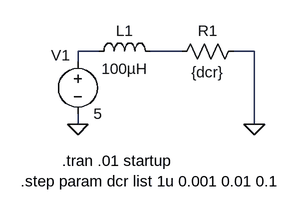
[diagram p0: schematic runaway_inductor.asc]
runaway_inductor.asc, the LTspice schematic file:
Version 4
SHEET 1 880 680
WIRE 128 160 96 160
WIRE 256 160 208 160
WIRE 368 160 336 160
WIRE 96 176 96 160
WIRE 96 272 96 256
WIRE 368 272 368 160
FLAG 96 272 0
FLAG 368 272 0
SYMBOL ind 112 176 R270
WINDOW 0 32 56 VTop 2
WINDOW 3 5 56 VBottom 2
SYMATTR InstName L1
SYMATTR Value 100µH
SYMBOL voltage 96 160 R0
WINDOW 0 -41 6 Left 2
WINDOW 123 0 0 Left 2
WINDOW 39 0 0 Left 2
SYMATTR InstName V1
SYMATTR Value 5
SYMBOL res 352 144 R90
WINDOW 0 0 56 VBottom 2
WINDOW 3 32 56 VTop 2
SYMATTR InstName R1
SYMATTR Value {dcr}
TEXT 72 328 Left 2 !.tran .01 startup
TEXT 8 360 Left 2 !.step param dcr list 1u 0.001 0.01 0.1

The netlist it stands for:
* runaway_inductor.asc
L1 N001 N002 100µH
V1 N001 0 5
R1 0 N002 {dcr}
.tran .01 startup
.step param dcr list 1u 0.001 0.01 0.1
.backanno
.end